# EAGLE design USB_module (EAGLE 7.2.0)
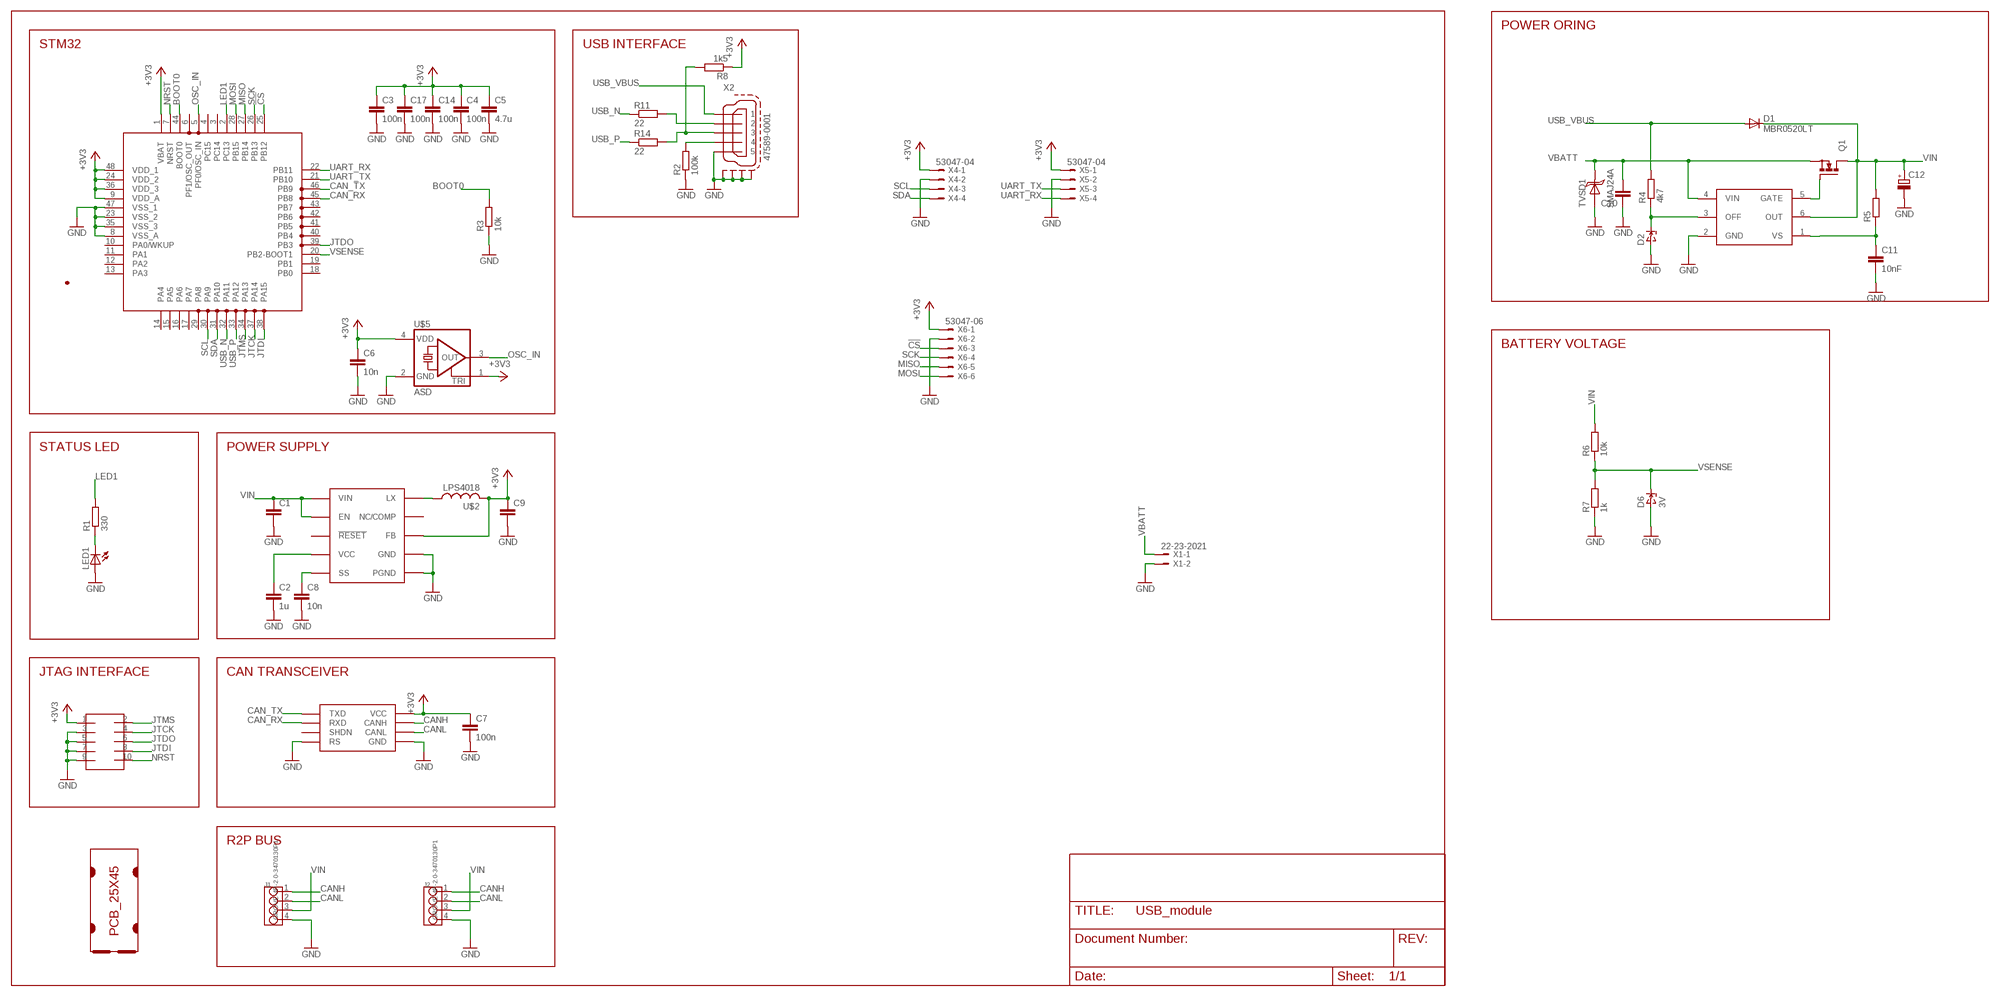
[diagram p0: schematic, sheet 1]

## Parts
C1  C-EUC1206  [C1206]
C2  1u  C-EUC0603  [C0603]
C3  100n  C-EUC0603  [C0603]
C4  100n  C-EUC0603  [C0603]
C5  4.7u  C-EUC0805  [C0805]
C6  10n  C-EUC0603  [C0603]
C7  100n  C-EUC0603  [C0603]
C8  10n  C-EUC0603  [C0603]
C9  C-EUC0805  [C0805]
C10  C-EUC0805  [C0805]
C11  10nF  C-EUC0603  [C0603]
C12  CPOL-EUE3.5-8  [E3,5-8]
C14  100n  C-EUC0603  [C0603]
C17  100n  C-EUC0603  [C0603]
D1  MBR0520LT  [SOD123]
D2  ZENERSOD-323F  [SOD-323F]
D6  3V  ZENERSOD-323F  [SOD-323F]
J1  GROVE-4P-2.0-3470130P1  [4P-2.0]
J2  GROVE-4P-2.0-3470130P1  [4P-2.0]
LED1  LEDCHIPLED_0805  [CHIPLED_0805]
Q1  N-MOSFET-SO8S  [SO-08]
R1  330  R-EU_R0603  [R0603]
R2  100k  R-EU_R0603  [R0603]
R3  10k  R-EU_R0603  [R0603]
R4  4k7  R-EU_R0603  [R0603]
R5  R-EU_R0603  [R0603]
R6  10k  R-EU_R0603  [R0603]
R7  1k  R-EU_R0603  [R0603]
R8  1k5  R-EU_R0603  [R0603]
R11  22  R-EU_R0603  [R0603]
R14  22  R-EU_R0603  [R0603]
SOT1  MAX3051EKA  [SOT23-8L]
TVSD1  SMAJ24A  TVSDSMA  [SMA]
U$1  PCB_25X45  [25X45]
U$2  LPS4018  [LPS4018]
U$3  MAX17501  [TDFN-10]
U$4  FTSH-105TH  [FTSH-105-TH]
U$5  ASD  [2.5X2]
U$6  STM32F303C  [LQFP48]
U$7  LM5050-1  [SOT23-6L]
X1  22-23-2021  [22-23-2021]
X2  47589-0001  [47589-0001]
X4  53047-04  [53047-04]
X5  53047-04  [53047-04]
X6  53047-06  [53047-06]

## Nets
!CS: U$6.25(PB12) X6.3
+3V3: C3.1 C4.1 C5.1 C6.1 C7.1 C9.1 C14.1 C17.1 R8.1 SOT1.3(VCC) U$2.P$2 U$3.P$5(FB) U$4.1 U$5.1(TRI) U$5.4(VDD) U$6.1(VBAT) U$6.9(VDD_A) U$6.24(VDD_2) U$6.36(VDD_3) U$6.48(VDD_1) X4.1 X5.1 X6.1
BOOT0: R3.2 U$6.44(BOOT0)
CAN_RX: SOT1.4(RXD) U$6.45(PB8)
CAN_TX: SOT1.1(TXD) U$6.46(PB9)
CANH: J1.1 J2.1 SOT1.7(CANH)
CANL: J1.2 J2.2 SOT1.6(CANL)
GND: C1.2 C2.2 C3.2 C4.2 C5.2 C6.2 C7.2 C8.2 C9.2 C10.1 C11.2 C12.- C14.2 C17.2 D2.A D6.A J1.4 J2.4 LED1.A R2.1 R3.1 R7.1 SOT1.2(GND) SOT1.8(RS) TVSD1.A U$3.P$1(PGND) U$3.P$9(GND) U$3.P$11(PGND) U$4.3 U$4.5 U$4.7 U$4.9 U$5.2(GND) U$6.8(VSS_A) U$6.23(VSS_2) U$6.35(VSS_3) U$6.47(VSS_1) U$7.2(GND) X1.2 X2.5 X2.SHLD1 X2.SHLD2 X2.SHLD3 X2.SHLD4 X4.2 X5.2 X6.2
JTCK: U$4.4 U$6.37(PA14)
JTDI: U$4.8 U$6.38(PA15)
JTDO: U$4.6 U$6.39(PB3)
JTMS: U$4.2 U$6.34(PA13)
LED1: R1.2 U$6.2(PC13)
MISO: U$6.27(PB14) X6.5
MOSI: U$6.28(PB15) X6.6
N$1: U$2.P$1 U$3.P$10(LX)
N$3: R11.2 X2.2
N$4: LED1.C R1.1
N$5: R2.2 X2.4
N$6: D2.C R4.1 U$7.3(OFF)
N$7: C2.1 U$3.P$4(VCC)
N$8: C8.1 U$3.P$6(SS)
N$9: Q1.4(G) U$7.5(GATE)
N$10: C11.1 R5.1 U$7.1(VS)
N$32: R8.2 R14.2 X2.3
NRST: U$4.10 U$6.7(NRST)
OSC_IN: U$5.3(OUT) U$6.5(PF0/OSC_IN)
SCK: U$6.26(PB13) X6.4
SCL: U$6.30(PA9) X4.3
SDA: U$6.31(PA10) X4.4
UART_RX: U$6.22(PB11) X5.4
UART_TX: U$6.21(PB10) X5.3
USB_N: R11.1 U$6.32(PA11)
USB_P: R14.1 U$6.33(PA12)
USB_VBUS: D1.A R4.2 X2.1
VBATT: C10.2 Q1.1(S) Q1.2(S) Q1.3(S) TVSD1.C(K) U$7.4(VIN) X1.1
VIN: C1.1 C12.+ D1.C J1.3 J2.3 Q1.5(D) Q1.6(D) Q1.7(D) Q1.8(D) R5.2 R6.2 U$3.P$2(VIN) U$3.P$3(EN) U$7.6(OUT)
VSENSE: D6.C R6.1 R7.2 U$6.20(PB2-BOOT1)
Unconnected: SOT1.5(SHDN) U$3.P$7(NC/COMP) U$3.P$8(!RESET) U$6.3(PC14) U$6.4(PC15) U$6.6(PF1/OSC_OUT) U$6.10(PA0/WKUP) U$6.11(PA1) U$6.12(PA2) U$6.13(PA3) U$6.14(PA4) U$6.15(PA5) U$6.16(PA6) U$6.17(PA7) U$6.18(PB0) U$6.19(PB1) U$6.29(PA8) U$6.40(PB4) U$6.41(PB5) U$6.42(PB6) U$6.43(PB7)

## Notes on the sheet
- POWER ORING
- STM32 | USB INTERFACE
- BATTERY VOLTAGE
- STATUS LED | POWER SUPPLY
- JTAG INTERFACE | CAN TRANSCEIVER
- R2P BUS

## Library data of the parts
C1-C11 C14 C17 = rcl:C-EU: CAPACITOR, European symbol
C12 = rcl:CPOL-EU: POLARIZED CAPACITOR, European symbol
D1 = diode:MBR0520LT: SCHOTTKY BARRIER RECTIFIER Source: http://onsemi.com .. MBR0520LT1-D.pdf
D2 D6 = dp_devices:ZENER: Zener Diode SOD-323
J1 J2 = OPL Eagle Library:GROVE-4P-2.0
LED1 = led:LED: LED OSRAM: - CHIPLED LG R971, LG N971, LY N971, LG Q971, LY Q971, LO R971, LY R971 LH N974, LH R974 LS Q976, LO Q976, LY Q976 LO Q996 - Hyper CHIPLED LW Q18S LB Q993, LB Q99A, LB R99A - SideLED LS A670, LO A670, LY A670, LG A670, LP A670 LB A673, LV A673, LT A673, LW A673 LH A674 LY A675 LS A676, LA A676, LO A676, LY A676, LW A676 LS A679, LY A679, LG A679 - Hyper Micro SIDELED® LS Y876, LA Y876, LO Y876, LY Y876 LT Y87S - SmartLED LW L88C, LW L88S LB L89C, LB L89S, LG L890 LS L89K, LO L89K, LY L89K LS L896, LA L896, LO L896, LY L896 - TOPLED LS T670, LO T670, LY T670, LG T670, LP T670 LSG T670, LSP T670, LSY T670, LOP T670, LYG T670 LG T671, LOG T671, LSG T671 LB T673, LV T673, LT T673, LW T673 LH T674 LS T676, LA T676, LO T676, LY T676, LB T676, LH T676, LSB T676, LW T676 LB T67C, LV T67C, LT T67C, LS T67K, LO T67K, LY T67K, LW E67C LS E67B, LA E67B, LO E67B, LY E67B, LB E67C, LV E67C, LT E67C LW T67C LS T679, LY T679, LG T679 LS T770, LO T770, LY T770, LG T770, LP T770 LB T773, LV T773, LT T773, LW T773 LH T774 LS E675, LA E675, LY E675, LS T675 LS T776, LA T776, LO T776, LY T776, LB T776 LHGB T686 LT T68C, LB T68C - Hyper Mini TOPLED® LB M676 - Mini TOPLED Santana® LG M470 LS M47K, LO M47K, LY M47K Source: http://www.osram.convergy.de LUXEON: - LUMILED® LXK2-PW12-R00, LXK2-PW12-S00, LXK2-PW14-U00, LXK2-PW14-V00 LXK2-PM12-R00, LXK2-PM12-S00, LXK2-PM14-U00 LXK2-PE12-Q00, LXK2-PE12-R00, LXK2-PE12-S00, LXK2-PE14-T00, LXK2-PE14-U00 LXK2-PB12-K00, LXK2-PB12-L00, LXK2-PB12-M00, LXK2-PB14-N00, LXK2-PB14-P00, LXK2-PB14-Q00 LXK2-PR12-L00, LXK2-PR12-M00, LXK2-PR14-Q00, LXK2-PR14-R00 LXK2-PD12-Q00, LXK2-PD12-R00, LXK2-PD12-S00 LXK2-PH12-R00, LXK2-PH12-S00 LXK2-PL12-P00, LXK2-PL12-Q00, LXK2-PL12-R00 Source: www.luxeon.com KINGBRIGHT: KA-3528ASYC Source: www.kingbright.com
Q1 = transistor-power:N-MOSFET-SO8: N-Channel MOSFET Example: FDS7760A; N-Channel Logic Level PowerTrench® MOSFET FDS2572; N-Channel UltraFET® Trench MOSFET Source: www.fairchildsemi.com
R1-R8 R11 R14 = rcl:R-EU_: RESISTOR, European symbol
SOT1 = maxim:MAX3051
TVSD1 = TVSD:TVSD
U$1 = r2p_pcb:PCB_25X45
U$2 = coilcraft:LPS4018
U$3 = maxim:MAX17501
U$4 = samtec:FTSH-105
U$5 = abracon:ASD
U$6 = st:STM32F303C
U$7 = texas-instruments:LM5050-1
X1 = con-molex:22-23-2021: .100" (2.54mm) Center Header - 2 Pin; MF: MOLEX; MPN: 22-23-2021; OC_FARNELL: 1462926; OC_NEWARK: 25C3832
X2 = molex:47589-0001
X4 X5 = con-molex:53?-04: CONNECTOR wire to board 1.25 mm (.049 inch) pitch header; MF: WALDOM/MOLEX; MPN: 53047-0410; OC_FARNELL: 9733060; OC_NEWARK: 38C9900
X6 = con-molex:53?-06: CONNECTOR wire to board 1.25 mm (.049 inch) pitch header; MPN: 53047-0610-C; OC_FARNELL: 9733078; OC_NEWARK: 03M2965

## Board
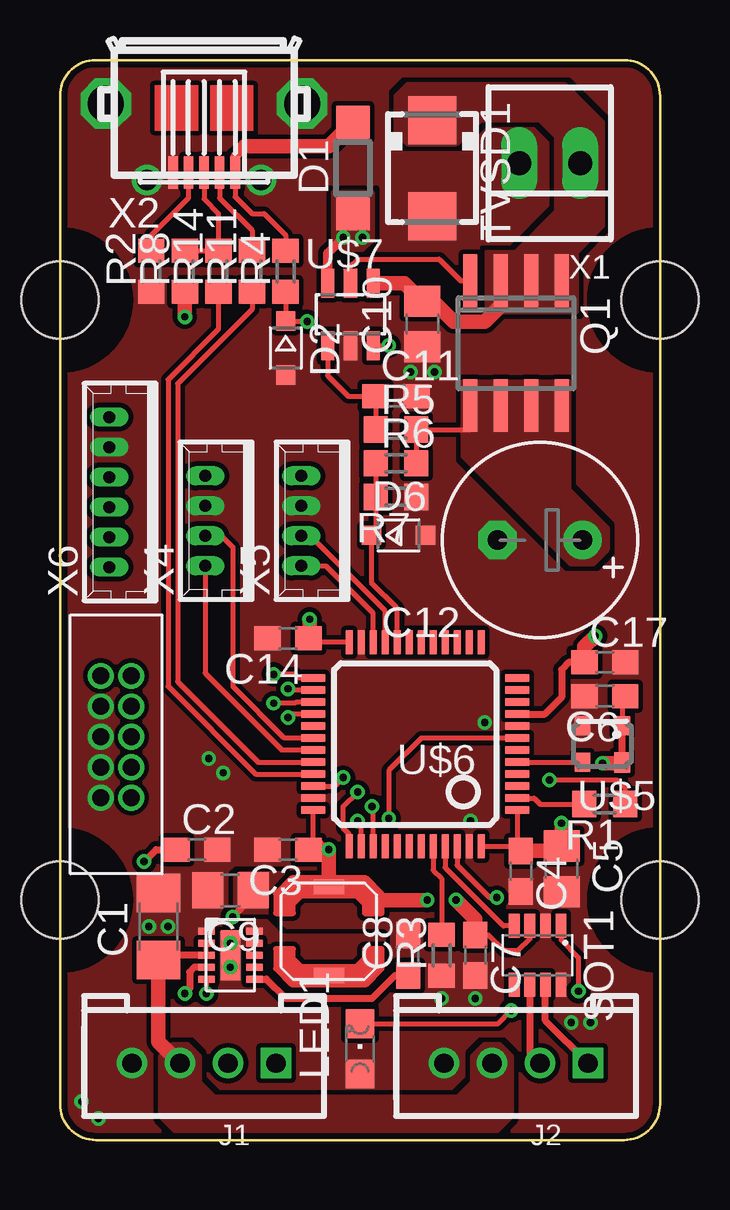
[diagram p1: board, top side]
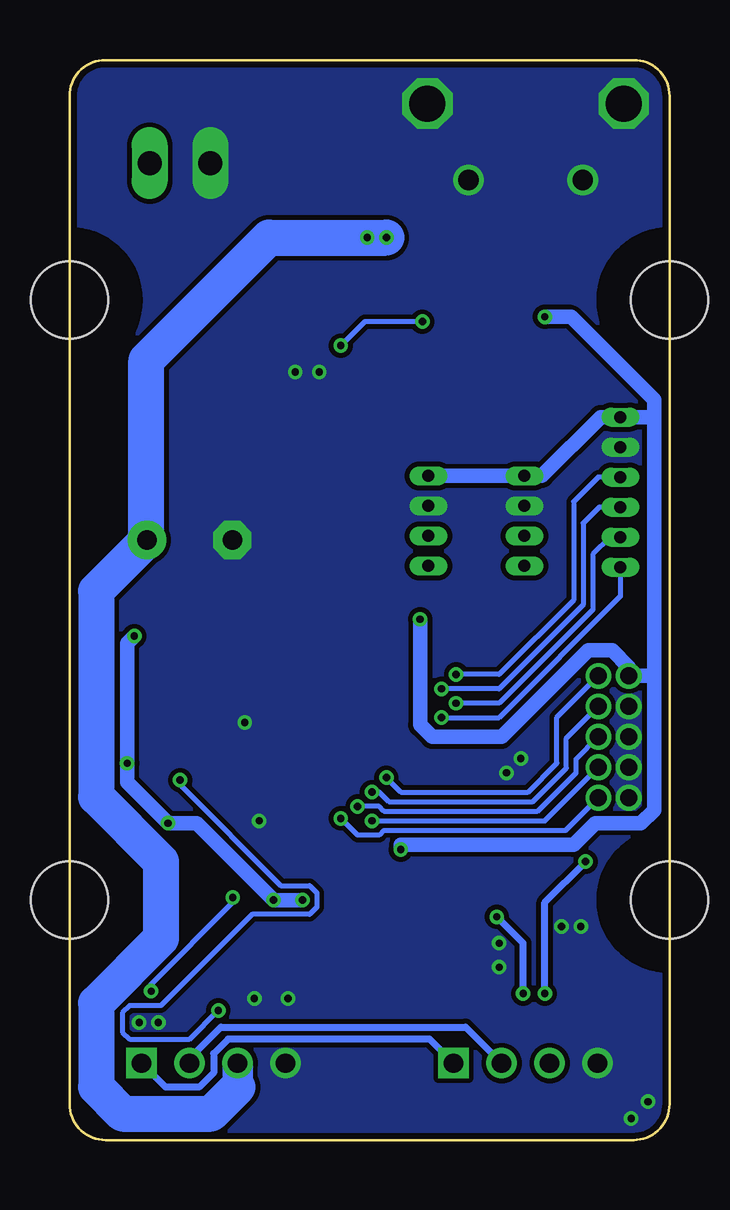
[diagram p2: board, bottom side, seen from below]

Size 25 x 45 mm. Coordinates in mm from the lower left corner, seen from the top.
Copper layers (1*16): Top 0.035mm / dielectric 1.5mm / Bottom 0.035mm
Design rules "test": minimum track width 0.2mm, minimum drill 0.3mm, track to track 0.2mm, track to pad 0.2mm, pad to pad 0.2mm, via to via 0.2mm, smd to smd 0mil, copper to edge 10mil, drill to drill 10mil, minimum pad ring 0.15mm, minimum via ring 0.15mm, stop-mask expansion 2mil, vias tented up to drill 100mil, thermal gap 10mil
tRestrict: 2 lines

### Footprints (pad centres in the part's own frame; a part is rotated, then mirrored left to right if it is on the bottom)
C1206 = smd 1.6 x 1.8: 1 -1.4,0; 2 1.4,0
C0603 = smd 1.1 x 1: 1 -0.85,0; 2 0.85,0
C0805 = smd 1.3 x 1.5: 1 -0.95,0; 2 0.95,0
E3,5-8 = drill 0.813 pad 1.6: + -1.778,0 | drill 0.813 pad 1.6 octagon: - 1.778,0
SOD123 = smd 1.4 x 1.4: A 1.9,0; C -1.9,0
SOD-323F = smd 0.8 x 0.8: A 1.125,0; C -1.125,0
4P-2.0 = drill 0.8 pad 1.27 square: 1 -3,0 | drill 0.8 pad 1.27: 2 -1,0; 3 1,0; 4 3,0
CHIPLED_0805 = smd 1.2 x 1.2: A 0,-1.05; C 0,1.05
SO-08 = smd 0.6 x 2.2: 1 -1.905,-2.6; 2 -0.635,-2.6; 3 0.635,-2.6; 4 1.905,-2.6; 5 1.905,2.6; 6 0.635,2.6; 7 -0.635,2.6; 8 -1.905,2.6
R0603 = smd 1 x 1.1: 1 -0.85,0; 2 0.85,0
SOT23-8L = smd 0.45 x 1: 1 -0.975,-1.225; 2 -0.325,-1.225; 3 0.325,-1.225; 4 0.975,-1.225; 5 0.975,1.225; 6 0.325,1.225; 7 -0.325,1.225; 8 -0.975,1.225
SMA = smd 2 x 2: A 2,0; C -2,0
25X45 = hole 3.2: 0,10; 25,10; 0,35; 25,35
LPS4018 = smd 0.635 x 1.27: P$1 -1.85,0; P$2 1.85,0
TDFN-10 = smd 0.7 x 0.3: P$1 -1,1; P$2 -1,0.5; P$3 -1,0; P$4 -1,-0.5; P$5 -1,-1; P$6 1,-1; P$7 1,-0.5; P$8 1,0; P$9 1,0.5; P$10 1,1 | smd 0.8 x 2.08: P$11 0,0
FTSH-105-TH = drill 0.711 pad 1.016: 1 -2.54,0; 2 -2.54,1.27; 3 -1.27,0; 4 -1.27,1.27; 5 0,0; 6 0,1.27; 7 1.27,0; 8 1.27,1.27; 9 2.54,0; 10 2.54,1.27
2.5X2 = smd 0.65 x 0.8: 1 -0.825,-0.762; 2 0.825,-0.762; 3 0.825,0.762 | smd 0.65 x 0.85: 4 -0.825,0.762
LQFP48 = smd 1 x 0.3: 1 -4.25,2.75; 2 -4.25,2.25; 3 -4.25,1.75; 4 -4.25,1.25; 5 -4.25,0.75; 6 -4.25,0.25; 7 -4.25,-0.25; 8 -4.25,-0.75; 9 -4.25,-1.25; 10 -4.25,-1.75; 11 -4.25,-2.25; 12 -4.25,-2.75; 25 4.25,-2.75; 26 4.25,-2.25; 27 4.25,-1.75; 28 4.25,-1.25; 29 4.25,-0.75; 30 4.25,-0.25; 31 4.25,0.25; 32 4.25,0.75; 33 4.25,1.25; 34 4.25,1.75; 35 4.25,2.25; 36 4.25,2.75 | smd 0.3 x 1: 13 -2.75,-4.25; 14 -2.25,-4.25; 15 -1.75,-4.25; 16 -1.25,-4.25; 17 -0.75,-4.25; 18 -0.25,-4.25; 19 0.25,-4.25; 20 0.75,-4.25; 21 1.25,-4.25; 22 1.75,-4.25; 23 2.25,-4.25; 24 2.75,-4.25; 37 2.75,4.25; 38 2.25,4.25; 39 1.75,4.25; 40 1.25,4.25; 41 0.75,4.25; 42 0.25,4.25; 43 -0.25,4.25; 44 -0.75,4.25; 45 -1.25,4.25; 46 -1.75,4.25; 47 -2.25,4.25; 48 -2.75,4.25
SOT23-6L = smd 0.55 x 1.2: 1 -0.95,-1.3; 2 0,-1.3; 3 0.95,-1.3; 4 0.95,1.3; 5 0,1.3; 6 -0.95,1.3
22-23-2021 = drill 1 long: 1 -1.27,0; 2 1.27,0
47589-0001 = smd 1.35 x 0.4: 1 2.68,1.3; 2 2.68,0.65; 3 2.68,0; 4 2.68,-0.65; 5 2.68,-1.3 | drill 1.5 pad 1.9 octagon: SHLD1 -0.18,4.09; SHLD2 -0.18,-4.09 | drill 0.85 pad 1.1: SHLD3 3,2.38; SHLD4 3,-2.38
53047-04 = drill 0.5 pad 0.698 long: 1 1.875,0.45; 2 0.625,0.45; 3 -0.625,0.45; 4 -1.875,0.45
53047-06 = drill 0.5 pad 0.698 long: 1 3.125,0.45; 2 1.875,0.45; 3 0.625,0.45; 4 -0.625,0.45; 5 -1.875,0.45; 6 -3.125,0.45

### Placement (x,y rotation side)
C1  4.1,8.9 90 top
C2  5.7,12.1 0 top
C3  9.5,12.1 180 top
C4  19.2,11.2 270 top
C5  20.9,11.3 270 top
C6  22.7,18.5 180 top
C7  17.3,7.7 270 top
C8  14.5,7.7 90 top
C9  7.1,10.4 180 top
C10  15.1,34 90 top
C11  14,31 0 top
C12  20,25 180 top
C14  9.5,20.9 180 top
C17  22.7,19.9 0 top
D1  12.2,40.5 90 top
D2  9.4,33 270 top
D6  14.1,25.2 0 top
J1  6,3.2 180 top
J2  19,3.2 180 top
LED1  12.5,3.8 0 top
Q1  19,33.2 180 top
R1  22.7,14 180 top
R2  3.8,36.2 90 top
R3  15.9,7.7 90 top
R4  9.4,36.2 90 top
R5  14,29.6 0 top
R6  14,28.2 0 top
R7  14,26.8 180 top
R8  5.2,36.2 90 top
R11  8,36.2 90 top
R14  6.6,36.2 90 top
SOT1  19.9,7.7 180 top
TVSD1  15.5,40.5 270 top
U$1  0,0 0 top
U$2  11.2,8.7 90 top
U$3  7.1,7.7 0 top
U$4  1.7,16.8 270 top
U$5  22.6,16.5 180 top
U$6  14.8,16.5 180 top
U$7  12.1,34.4 0 top
X1  20.4,40.7 180 top
X2  6,43 270 top
X4  6.5,25.8 90 top
X5  10.5,25.8 90 top
X6  2.5,27 90 top

### Tracks (layer width: path | path; a pad name or v marks a point on that pad's centre or on a via)
!CS  (via drill 0.3)
  Top 0.2: U$6.25 9.95,19.25 9.8,19.4 v8.9,19.4
  Bottom 0.2: X6.3 2.98,27.62 4,26.6 4,22.5 7.1,19.4 v8.9,19.4
+3V3  (via drill 0.3)
  Top 0.2: U$3.P$5 v6.1,6.1 | C7.1 17.85,8.55 18.5,7.9 19.1,7.9 19.57,8.38 SOT1.3 | C3.1 10.55,12.3 U$6.36 | 19,12.25 C4.1 | U$6.1 19.05,12.2 C4.1 | 10.5,20.75 10.4,20.85 | U$6.24 10.35,20.75 C14.1 | U$6.48 19.2,12.25 C4.1 | C6.1 23.43,18.38 U$5.1
  Top 0.3: 8.05,10.55 8.05,10.75 7.95,10.75 | U$6.9 20.2,17.75 20.9,18.45 20.9,19.6 21.2,19.9 C17.1 | v7.2,9.3 8.05,10.15 C9.1 | U$5.4 U$5.1
  Top 0.6: U$2.P$2 v11.2,12.1 C3.1 | 10.55,12.3 10.7,12.3 | C4.1 20.7,12.05 C5.1 v20.9,13.2 | C7.1 17.3,9.2 v16.5,10 | v15.3,10 13,10 | v10.4,21.7 10.4,20.85 C14.1 | v22.3,21 21.85,20.55 C17.1 | v5.2,34.3 R8.1 | U$5.4 23.39,15.7 v22.6,15.7
  Bottom 0.3: v6.1,6.1 6.1,8.2 v7.2,9.3
  Bottom 0.6: v15.3,10 v16.5,10 19.7,13.2 v20.9,13.2 22.6,14.9 v22.6,15.7 22.6,20.7 v22.3,21 | v11.2,12.1 11.2,12.3 4,12.3 3.1,13.2 1.2,13.2 0.65,13.75 0.65,19.34 | 0.65,19.34 U$4.1 1.7,19.7 2.4,20.4 3.4,20.4 7,16.8 9.9,16.8 10.4,17.3 v10.4,21.7 | 0.65,19.34 0.65,30 | 0.65,30 0.65,30.85 4.1,34.3 v5.2,34.3 | X5.1 X4.1 5.33,27.68 2.88,30.12 X6.1 0.78,30.12 0.65,30
  pour Top (rank 5, no thermals): 13.3,8.9 13.5,9.1 13.5,10.3 12.8,11 9.5,11 9.4,11.1 7.5,11.1 7.3,10.9 7.3,9.8 8.3,8.9
BOOT0
  Top 0.2: U$6.44 15.55,11.25 15.9,10.9 R3.2
CAN_RX
  Top 0.2: U$6.45 16.05,11.35 18.4,9 18.48,8.93 SOT1.4
CAN_TX  (via drill 0.3)
  Top 0.2: U$6.46 16.55,11.45 17.9,10.1 v18.2,10.1 | SOT1.1 20.88,8.32 21.6,7.6 v21.6,6.2
  Bottom 0.2: v21.6,6.2 21.6,6.5 18.2,9.9 v18.2,10.1
CANH
  Top 0.3: J2.1 20.23,4.97 SOT1.7
  Bottom 0.3: J1.1 10,4.2 18.4,4.2 19,3.6 19,2.8 19.6,2.2 21,2.2 J2.1
CANL
  Top 0.3: 19.57,3.62 J2.2 19.57,3.62 | SOT1.6 19.57,3.62
  Bottom 0.3: J1.2 8.5,4.7 18.7,4.7 20,3.4 J2.2
GND  (via drill 0.3)
  other vias: 7.1,8.2 7.1,7.2 4.5,8.9 3.7,8.9 15.9,5.9 17.3,5.9 21.3,4.9 22.1,4.9 1.6,0.9 0.9,1.6 17.7,17.4 14.6,32 15.6,32 17.1,13.3 6.2,15.9 6.8,15.3
  pour Bottom (no thermals): 0,0 25,0 25,45 0,45
  pour Top (rank 6, no thermals): 0,0 25,0 25,45 0,45
JTCK  (via drill 0.3)
  Top 0.2: U$6.37 12.05,12.75 11.8,13 11.8,13.9 v12.4,14.5
  Bottom 0.2: v12.4,14.5 12.1,14.5 11.7,14.1 5.7,14.1 4.3,15.5 4.3,16.74 U$4.4
JTDI  (via drill 0.3)
  Top 0.2: U$6.38 12.55,13.15 v12.4,13.3
  Bottom 0.2: v12.4,13.3 5.2,13.3 U$4.8
JTDO  (via drill 0.3)
  Top 0.2: U$6.39 13.05,13.85 v13,13.9
  Bottom 0.2: v13,13.9 12.1,13.9 11.9,13.7 5.5,13.7 3.9,15.3 3.9,15.87 U$4.6
JTMS  (via drill 0.3)
  Top 0.2: U$6.34 11.45,14.75 v11.8,15.1
  Bottom 0.2: v11.8,15.1 11.2,14.5 5.9,14.5 4.7,15.7 4.7,17.61 U$4.2
LED1
  Top 0.2: U$6.2 19.75,14.25 20,14 R1.2
MISO  (via drill 0.3)
  Top 0.2: U$6.27 9.85,18.25 9.8,18.2 v8.9,18.2
  Bottom 0.2: X6.5 2.48,25.12 3.2,24.4 3.2,22.1 7.1,18.2 v8.9,18.2
MOSI  (via drill 0.3)
  Top 0.2: U$6.28 9.65,17.75 v9.5,17.6
  Bottom 0.2: v9.5,17.6 7.1,17.6 2.05,22.65 X6.6
N$1
  pour Top (no thermals): 7.8,8.7 8.2,8.7 8.5,8.2 8.5,7.5 9.6,6.4 12.8,6.4 13.5,7.1 13.5,8.3 13.3,8.5 9.2,8.5 8.6,9.1 7.8,9.1
N$3
  Top 0.2: X2.2 6.65,39.25 8,37.9 R11.2
N$4  (via drill 0.3)
  Top 0.2: LED1.C 18.25,4.85 v18.8,5.4 | R1.1 23.55,14.65 23.2,15 v20.4,15
  Bottom 0.2: v20.4,15 20.4,14.8 16.2,10.6 15,10.6 14.7,10.3 14.7,9.7 15,9.4 17.4,9.4 21.2,5.6 22.5,5.6 22.8,5.3 22.8,4.5 22.5,4.2 20,4.2 v18.8,5.4
N$5
  Top 0.2: X2.4 5.35,39.25 3.8,37.7 R2.2
N$6  (via drill 0.3)
  Top 0.2: R4.1 D2.C 10.28,34.12 v10.3,34.1 | U$7.3 v13.7,33.1
  Bottom 0.2: v10.3,34.1 12.7,34.1 v13.7,33.1
N$7  (via drill 0.3)
  Top 0.3: U$3.P$4 5.6,7.2 5.4,7 5.4,6.3 v5.2,6.1 | v3.5,11.6 4,12.1 C2.1
  Bottom 0.3: v5.2,6.1 5.2,9.9 v3.5,11.6
N$8
  Top 0.3: U$3.P$6 8.6,6.7 9.4,5.9 13,5.9 13.95,6.85 C8.1
N$9
  Top 0.2: U$7.5 12.1,36.4 12.4,36.7 15.8,36.7 16.7,35.8 Q1.4
N$10
  Top 0.2: R5.1 C11.1 12,31 11.15,31.85 U$7.1
N$32
  Top 0.2: X2.3 6,39.2 6.6,38.6 R14.2 R8.2
NRST  (via drill 0.3)
  Top 0.2: U$6.7 15.05,16.75 13.7,15.4 v13.7,13.4
  Bottom 0.2: v13.7,13.4 13,12.7 12.7,12.7 12.1,12.7 11.9,12.9 4.33,12.9 U$4.10
OSC_IN
  Top 0.2: U$6.5 21.76,15.75 U$5.3
SCK  (via drill 0.3)
  Top 0.2: U$6.26 9.55,18.75 v9.5,18.8
  Bottom 0.2: X6.4 2.92,26.38 3.6,25.7 3.6,22.3 7.1,18.8 v9.5,18.8
SCL
  Top 0.2: X4.3 6.72,25.18 7.2,24.7 7.2,18.9 9.35,16.75 U$6.30
SDA
  Top 0.2: U$6.31 9.25,16.25 6.05,19.45 X4.4
UART_RX
  Top 0.2: X5.4 11.07,23.93 13,22 13.05,21.95 U$6.22
UART_TX
  Top 0.2: X5.3 10.43,25.18 13.5,22.1 13.55,22.05 U$6.21
USB_N
  Top 0.2: R11.1 8,34.62 4.9,31.52 4.9,19.1 8.25,15.75 U$6.32
USB_P
  Top 0.2: R14.1 6.6,33.78 4.5,31.68 4.5,18.9 8.15,15.25 U$6.33
USB_VBUS
  Top 0.2: X2.1 7.3,39.3 8,38.6 8.5,38.6 9.4,37.7 R4.2
  Top 0.4: X2.1 7.3,41 7.7,41.4
  Top 0.6: 7.7,41.4 11.2,41.4 D1.A
VBATT
  Top 0.6: Q1.3 18.36,34.77 17.7,34.1 16.4,34.1 15.55,34.95 C10.2 14.35,35.7 U$7.4
  pour Top (no thermals): 14.5,44 21,44 22.6,42.4 22.6,38.1 21.5,37 21.5,34.5 17.8,34.5 17.8,37 19,37 20.7,38.7 20.7,41.8 20,42.5 17.5,42.5 16.5,41.5 14.5,41.5 14,42 14,43.5
VIN  (via drill 0.3)
  Top 0.2: U$3.P$3 U$3.P$2 | R6.2 R5.2 17.1,29.6
  Top 0.3: U$3.P$3 4.3,7.7 C1.1
  Top 0.4: U$7.6 11.15,36.95 v11.8,37.6
  Top 0.6: C1.1 4.1,4.1 J1.3
  Bottom 1.27: 18,2.2 J2.3
  Bottom 1.5: C12.+ 21.8,24.98 | 21.8,24.98 23.9,22.88 23.9,14.3 21.2,11.6 21.2,8.4 23.9,5.7 23.9,2.2 22.8,1.1 19.1,1.1 18,2.2 | 21.8,24.98 21.8,32.5 16.7,37.6 v11.8,37.6
  other vias: 12.6,37.6
  pour Top (no thermals): 4.7,4 5.3,4 5.8,3.5 5.8,2.4 6.4,1.8 16.6,1.8 17.2,2.4 17.2,3.5 17.7,4 18.3,4 18.8,3.5 18.8,1 17.8,0 5.2,0 4.2,1 4.2,3.5
  pour Top (no thermals): 13,39.5 13,37.5 12.6,37.1 11.8,37.1 11.4,37.5 11.4,39.5
  pour Top (no thermals): 16.8,31.6 21.2,31.6 21.2,27.1 22.8,25.5 22.8,24.6 22.2,24 21.3,24 16.8,28.5
VSENSE
  Top 0.2: R6.1 R7.2 13.15,25.38 D6.C 12.97,23.23 14.05,22.15 U$6.20

### Text on the board
Document: SPI | I2C | UART